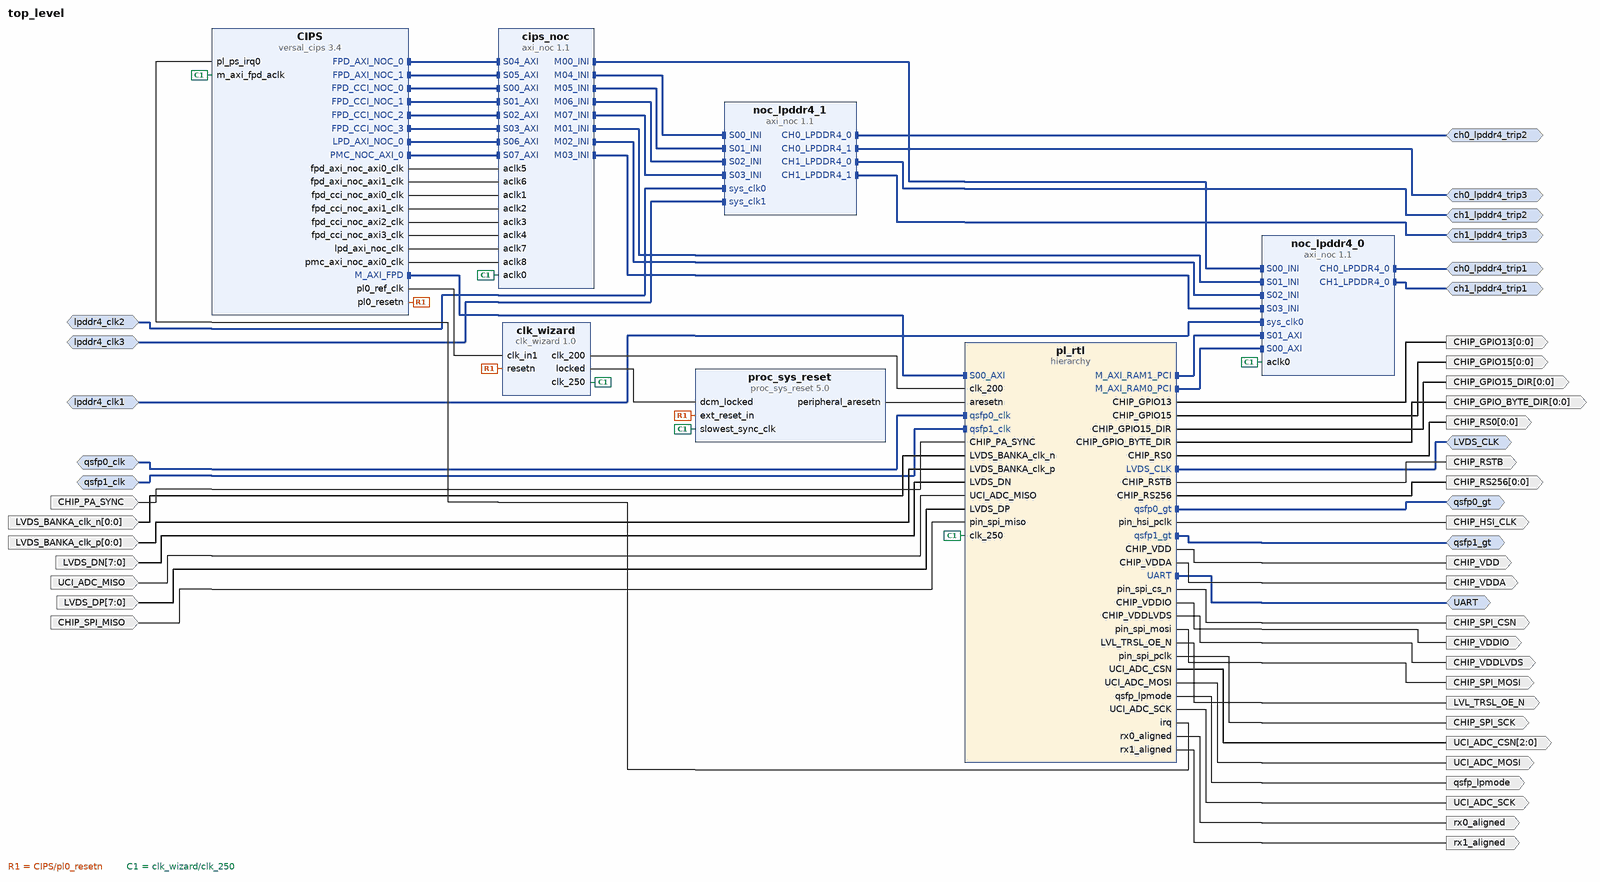
[diagram p0: block diagram of the top level]
# Vivado block design top_level, xcvp1202-vsva2785-2MP-e-S, Vivado 2024.2
create_bd_design top_level

create_bd_intf_port -mode Master -vlnv xilinx.com:interface:lpddr4_rtl:1.0 ch0_lpddr4_trip1
create_bd_intf_port -mode Master -vlnv xilinx.com:interface:lpddr4_rtl:1.0 ch0_lpddr4_trip2
create_bd_intf_port -mode Master -vlnv xilinx.com:interface:lpddr4_rtl:1.0 ch0_lpddr4_trip3
create_bd_intf_port -mode Master -vlnv xilinx.com:interface:lpddr4_rtl:1.0 ch1_lpddr4_trip1
create_bd_intf_port -mode Master -vlnv xilinx.com:interface:lpddr4_rtl:1.0 ch1_lpddr4_trip2
create_bd_intf_port -mode Master -vlnv xilinx.com:interface:lpddr4_rtl:1.0 ch1_lpddr4_trip3
create_bd_intf_port -mode Slave -vlnv xilinx.com:interface:diff_clock_rtl:1.0 lpddr4_clk1
set_property -dict {CONFIG.FREQ_HZ 200321000} [get_bd_intf_ports lpddr4_clk1]
create_bd_intf_port -mode Slave -vlnv xilinx.com:interface:diff_clock_rtl:1.0 lpddr4_clk2
set_property -dict {CONFIG.FREQ_HZ 200321000} [get_bd_intf_ports lpddr4_clk2]
create_bd_intf_port -mode Slave -vlnv xilinx.com:interface:diff_clock_rtl:1.0 lpddr4_clk3
set_property -dict {CONFIG.FREQ_HZ 200321000} [get_bd_intf_ports lpddr4_clk3]
create_bd_intf_port -mode Master -vlnv xilinx.com:interface:uart_rtl:1.0 UART
create_bd_intf_port -mode Master -vlnv xilinx.com:interface:diff_clock_rtl:1.0 LVDS_CLK
create_bd_intf_port -mode Master -vlnv xilinx.com:interface:gt_rtl:1.0 qsfp0_gt
create_bd_intf_port -mode Master -vlnv xilinx.com:interface:gt_rtl:1.0 qsfp1_gt
create_bd_intf_port -mode Slave -vlnv xilinx.com:interface:diff_clock_rtl:1.0 qsfp0_clk
set_property -dict {CONFIG.FREQ_HZ 156250000} [get_bd_intf_ports qsfp0_clk]
create_bd_intf_port -mode Slave -vlnv xilinx.com:interface:diff_clock_rtl:1.0 qsfp1_clk
set_property -dict {CONFIG.FREQ_HZ 156250000} [get_bd_intf_ports qsfp1_clk]
create_bd_port -dir O CHIP_SPI_CSN
create_bd_port -dir O CHIP_SPI_MOSI
create_bd_port -dir O CHIP_SPI_SCK
create_bd_port -dir I CHIP_SPI_MISO
create_bd_port -dir O -from 2 -to 0 UCI_ADC_CSN
create_bd_port -dir O UCI_ADC_SCK
create_bd_port -dir O UCI_ADC_MOSI
create_bd_port -dir I UCI_ADC_MISO
create_bd_port -dir O CHIP_RSTB
create_bd_port -dir O LVL_TRSL_OE_N
create_bd_port -dir O CHIP_HSI_CLK
create_bd_port -dir O CHIP_VDDIO
create_bd_port -dir O CHIP_VDDLVDS
create_bd_port -dir O CHIP_VDD
create_bd_port -dir O CHIP_VDDA
create_bd_port -dir O -from 0 -to 0 CHIP_RS0
create_bd_port -dir O -from 0 -to 0 CHIP_RS256
create_bd_port -dir O -from 0 -to 0 CHIP_GPIO_BYTE_DIR
create_bd_port -dir O -from 0 -to 0 CHIP_GPIO15
create_bd_port -dir O -from 0 -to 0 CHIP_GPIO13
create_bd_port -dir O -from 0 -to 0 CHIP_GPIO15_DIR
create_bd_port -dir I CHIP_PA_SYNC
create_bd_port -dir I -from 7 -to 0 LVDS_DP
create_bd_port -dir I -from 7 -to 0 LVDS_DN
create_bd_port -dir I -from 0 -to 0 LVDS_BANKA_clk_p
create_bd_port -dir I -from 0 -to 0 LVDS_BANKA_clk_n
create_bd_port -dir O rx0_aligned
create_bd_port -dir O qsfp_lpmode
create_bd_port -dir O rx1_aligned

create_bd_cell -type ip -vlnv xilinx.com:ip:versal_cips:3.4 CIPS
set_property -dict [list \
  CONFIG.CLOCK_MODE Custom \
  CONFIG.DDR_MEMORY_MODE Custom \
  CONFIG.PS_BOARD_INTERFACE ps_pmc_fixed_io \
  CONFIG.PS_PL_CONNECTIVITY_MODE Custom \
  CONFIG.PS_PMC_CONFIG {['CLOCK_MODE Custom', 'DDR_MEMORY_MODE Custom', 'DESIGN_MODE 1', 'DEVICE_INTEGRITY_MODE {Sysmon temperature voltage and external IO monitoring}', 'PMC_CRP_PL0_REF_CTRL_FREQMHZ 99.999992', 'PMC_GPIO0_MIO_PERIPHERAL {{ENABLE 1} {IO {PMC_MIO 0 .. 25}}}', 'PMC_GPIO1_MIO_PERIPHERAL {{ENABLE 1} {IO {PMC_MIO 26 .. 51}}}', 'PMC_MIO37 {{AUX_IO 0} {DIRECTION out} {DRIVE_STRENGTH 8mA} {OUTPUT_DATA high} {PULL pullup} {SCHMITT 0} {SLEW slow} {USAGE GPIO}}', 'PMC_QSPI_FBCLK {{ENABLE 1} {IO {PMC_MIO 6}}}', 'PMC_QSPI_PERIPHERAL_DATA_MODE x4', 'PMC_QSPI_PERIPHERAL_ENABLE 1', 'PMC_QSPI_PERIPHERAL_MODE {Dual Parallel}', 'PMC_REF_CLK_FREQMHZ 33.3333', 'PMC_SD1 {{CD_ENABLE 1} {CD_IO {PMC_MIO 28}} {POW_ENABLE 1} {POW_IO {PMC_MIO 51}} {RESET_ENABLE 0} {RESET_IO {PMC_MIO 12}} {WP_ENABLE 0} {WP_IO {PMC_MIO 1}}}', 'PMC_SD1_PERIPHERAL {{CLK_100_SDR_OTAP_DLY 0x3} {CLK_200_SDR_OTAP_DLY 0x2} {CLK_50_DDR_ITAP_DLY 0x36} {CLK_50_DDR_OTAP_DLY 0x3} {CLK_50_SDR_ITAP_DLY 0x2C} {CLK_50_SDR_OTAP_DLY 0x4} {ENABLE 1} {IO {PMC_MIO 26 .. 36}}}', 'PMC_SD1_SLOT_TYPE {SD 3.0}', 'PMC_USE_PMC_NOC_AXI0 1', 'PS_BOARD_INTERFACE ps_pmc_fixed_io', 'PS_ENET0_MDIO {{ENABLE 1} {IO {PS_MIO 24 .. 25}}}', 'PS_ENET0_PERIPHERAL {{ENABLE 1} {IO {PS_MIO 0 .. 11}}}', 'PS_GEN_IPI0_ENABLE 1', 'PS_GEN_IPI0_MASTER A72', 'PS_GEN_IPI1_ENABLE 1', 'PS_GEN_IPI1_MASTER A72', 'PS_GEN_IPI2_ENABLE 1', 'PS_GEN_IPI2_MASTER A72', 'PS_GEN_IPI3_ENABLE 1', 'PS_GEN_IPI3_MASTER A72', 'PS_GEN_IPI4_ENABLE 1', 'PS_GEN_IPI4_MASTER A72', 'PS_GEN_IPI5_ENABLE 1', 'PS_GEN_IPI5_MASTER A72', 'PS_GEN_IPI6_ENABLE 1', 'PS_GEN_IPI6_MASTER A72', 'PS_I2C0_PERIPHERAL {{ENABLE 1} {IO {PMC_MIO 46 .. 47}}}', 'PS_I2C1_PERIPHERAL {{ENABLE 1} {IO {PMC_MIO 44 .. 45}}}', 'PS_I2CSYSMON_PERIPHERAL {{ENABLE 0} {IO {PMC_MIO 39 .. 40}}}', 'PS_IRQ_USAGE {{CH0 1} {CH1 0} {CH10 0} {CH11 0} {CH12 0} {CH13 0} {CH14 0} {CH15 0} {CH2 0} {CH3 0} {CH4 0} {CH5 0} {CH6 0} {CH7 0} {CH8 0} {CH9 0}}', 'PS_MIO7 {{AUX_IO 0} {DIRECTION in} {DRIVE_STRENGTH 8mA} {OUTPUT_DATA default} {PULL disable} {SCHMITT 0} {SLEW slow} {USAGE Reserved}}', 'PS_MIO9 {{AUX_IO 0} {DIRECTION in} {DRIVE_STRENGTH 8mA} {OUTPUT_DATA default} {PULL disable} {SCHMITT 0} {SLEW slow} {USAGE Reserved}}', 'PS_NUM_FABRIC_RESETS 1', 'PS_PCIE_EP_RESET1_IO {PS_MIO 18}', 'PS_PCIE_EP_RESET2_IO {PS_MIO 19}', 'PS_PCIE_RESET {ENABLE 1}', 'PS_PL_CONNECTIVITY_MODE Custom', 'PS_TTC0_PERIPHERAL_ENABLE 1', 'PS_UART0_PERIPHERAL {{ENABLE 1} {IO {PMC_MIO 42 .. 43}}}', 'PS_USB3_PERIPHERAL {{ENABLE 1} {IO {PMC_MIO 13 .. 25}}}', 'PS_USE_FPD_AXI_NOC0 1', 'PS_USE_FPD_AXI_NOC1 1', 'PS_USE_FPD_CCI_NOC 1', 'PS_USE_M_AXI_FPD 1', 'PS_USE_NOC_LPD_AXI0 1', 'PS_USE_PMCPL_CLK0 1', 'SMON_ALARMS Set_Alarms_On', 'SMON_ENABLE_TEMP_AVERAGING 0', 'SMON_INTERFACE_TO_USE I2C', 'SMON_MEAS36 {{ALARM_ENABLE 1} {ALARM_LOWER 0.00} {ALARM_UPPER 2.00} {AVERAGE_EN 0} {ENABLE 1} {MODE {2 V unipolar}} {NAME VCCAUX} {SUPPLY_NUM 0}}', 'SMON_MEAS37 {{ALARM_ENABLE 1} {ALARM_LOWER 0.00} {ALARM_UPPER 2.00} {AVERAGE_EN 0} {ENABLE 1} {MODE {2 V unipolar}} {NAME VCCAUX_PMC} {SUPPLY_NUM 1}}', 'SMON_MEAS58 {{ALARM_ENABLE 1} {ALARM_LOWER 0.00} {ALARM_UPPER 2.00} {AVERAGE_EN 0} {ENABLE 1} {MODE {2 V unipolar}} {NAME VCC_PMC} {SUPPLY_NUM 2}}', 'SMON_MEAS59 {{ALARM_ENABLE 1} {ALARM_LOWER 0.00} {ALARM_UPPER 2.00} {AVERAGE_EN 0} {ENABLE 1} {MODE {2 V unipolar}} {NAME VCC_PSFP} {SUPPLY_NUM 3}}', 'SMON_MEAS60 {{ALARM_ENABLE 1} {ALARM_LOWER 0.00} {ALARM_UPPER 2.00} {AVERAGE_EN 0} {ENABLE 1} {MODE {2 V unipolar}} {NAME VCC_PSLP} {SUPPLY_NUM 4}}', 'SMON_MEAS62 {{ALARM_ENABLE 1} {ALARM_LOWER 0.00} {ALARM_UPPER 2.00} {AVERAGE_EN 0} {ENABLE 1} {MODE {2 V unipolar}} {NAME VCC_SOC} {SUPPLY_NUM 5}}', 'SMON_MEAS63 {{ALARM_ENABLE 1} {ALARM_LOWER 0.00} {ALARM_UPPER 1.00} {AVERAGE_EN 0} {ENABLE 1} {MODE {2 V unipolar}} {NAME VP_VN} {SUPPLY_NUM 6}}', 'SMON_PMBUS_ADDRESS 0x18', 'SMON_TEMP_AVERAGING_SAMPLES 0']} \
] [get_bd_cells CIPS]
create_bd_cell -type hier pl_rtl
create_bd_cell -type ip -vlnv xilinx.com:ip:axi_noc:1.1 cips_noc
set_property -dict {CONFIG.NUM_CLKS 9 CONFIG.NUM_MI 0 CONFIG.NUM_NMI 8 CONFIG.NUM_NSI 0 CONFIG.NUM_SI 8} [get_bd_cells cips_noc]
create_bd_cell -type ip -vlnv xilinx.com:ip:clk_wizard:1.0 clk_wizard
set_property -dict [list \
  CONFIG.CLKOUT_DRIVES BUFG,BUFG,BUFG,BUFG,BUFG,BUFG,BUFG \
  CONFIG.CLKOUT_DYN_PS None,None,None,None,None,None,None \
  CONFIG.CLKOUT_GROUPING Auto,Auto,Auto,Auto,Auto,Auto,Auto \
  CONFIG.CLKOUT_MATCHED_ROUTING false,false,false,false,false,false,false \
  CONFIG.CLKOUT_PORT clk_250,clk_200,clk_out3,clk_out4,clk_out5,clk_out6,clk_out7 \
  CONFIG.CLKOUT_REQUESTED_DUTY_CYCLE 50.000,50.000,50.000,50.000,50.000,50.000,50.000 \
  CONFIG.CLKOUT_REQUESTED_OUT_FREQUENCY 250,200,300.000,100.000,100.000,100.000,100.000 \
  CONFIG.CLKOUT_REQUESTED_PHASE 0.000,0.000,0.000,0.000,0.000,0.000,0.000 \
  CONFIG.CLKOUT_USED true,true,false,false,false,false,false \
  CONFIG.JITTER_SEL Min_O_Jitter \
  CONFIG.PRIM_SOURCE No_buffer \
  CONFIG.RESET_TYPE ACTIVE_LOW \
  CONFIG.USE_LOCKED true \
  CONFIG.USE_PHASE_ALIGNMENT true \
  CONFIG.USE_RESET true \
] [get_bd_cells clk_wizard]
create_bd_cell -type ip -vlnv xilinx.com:ip:axi_noc:1.1 noc_lpddr4_0
set_property -dict [list \
  CONFIG.CH0_LPDDR4_0_BOARD_INTERFACE ch0_lpddr4_trip1 \
  CONFIG.CH1_LPDDR4_0_BOARD_INTERFACE ch1_lpddr4_trip1 \
  CONFIG.MC_CHANNEL_INTERLEAVING true \
  CONFIG.MC_CHAN_REGION1 DDR_LOW1 \
  CONFIG.MC_CH_INTERLEAVING_SIZE 4K_Bytes \
  CONFIG.NUM_MCP 4 \
  CONFIG.NUM_MI 0 \
  CONFIG.NUM_NSI 4 \
  CONFIG.NUM_SI 2 \
  CONFIG.sys_clk0_BOARD_INTERFACE lpddr4_clk1 \
] [get_bd_cells noc_lpddr4_0]
create_bd_cell -type ip -vlnv xilinx.com:ip:axi_noc:1.1 noc_lpddr4_1
set_property -dict [list \
  CONFIG.CH0_LPDDR4_0_BOARD_INTERFACE ch0_lpddr4_trip2 \
  CONFIG.CH0_LPDDR4_1_BOARD_INTERFACE ch0_lpddr4_trip3 \
  CONFIG.CH1_LPDDR4_0_BOARD_INTERFACE ch1_lpddr4_trip2 \
  CONFIG.CH1_LPDDR4_1_BOARD_INTERFACE ch1_lpddr4_trip3 \
  CONFIG.MC_CHAN_REGION0 DDR_CH1 \
  CONFIG.NUM_MCP 4 \
  CONFIG.NUM_MI 0 \
  CONFIG.NUM_NSI 4 \
  CONFIG.NUM_SI 0 \
  CONFIG.sys_clk0_BOARD_INTERFACE lpddr4_clk2 \
  CONFIG.sys_clk1_BOARD_INTERFACE lpddr4_clk3 \
] [get_bd_cells noc_lpddr4_1]
create_bd_cell -type ip -vlnv xilinx.com:ip:proc_sys_reset:5.0 proc_sys_reset

# ---- hierarchy /pl_rtl ----
current_bd_instance /pl_rtl
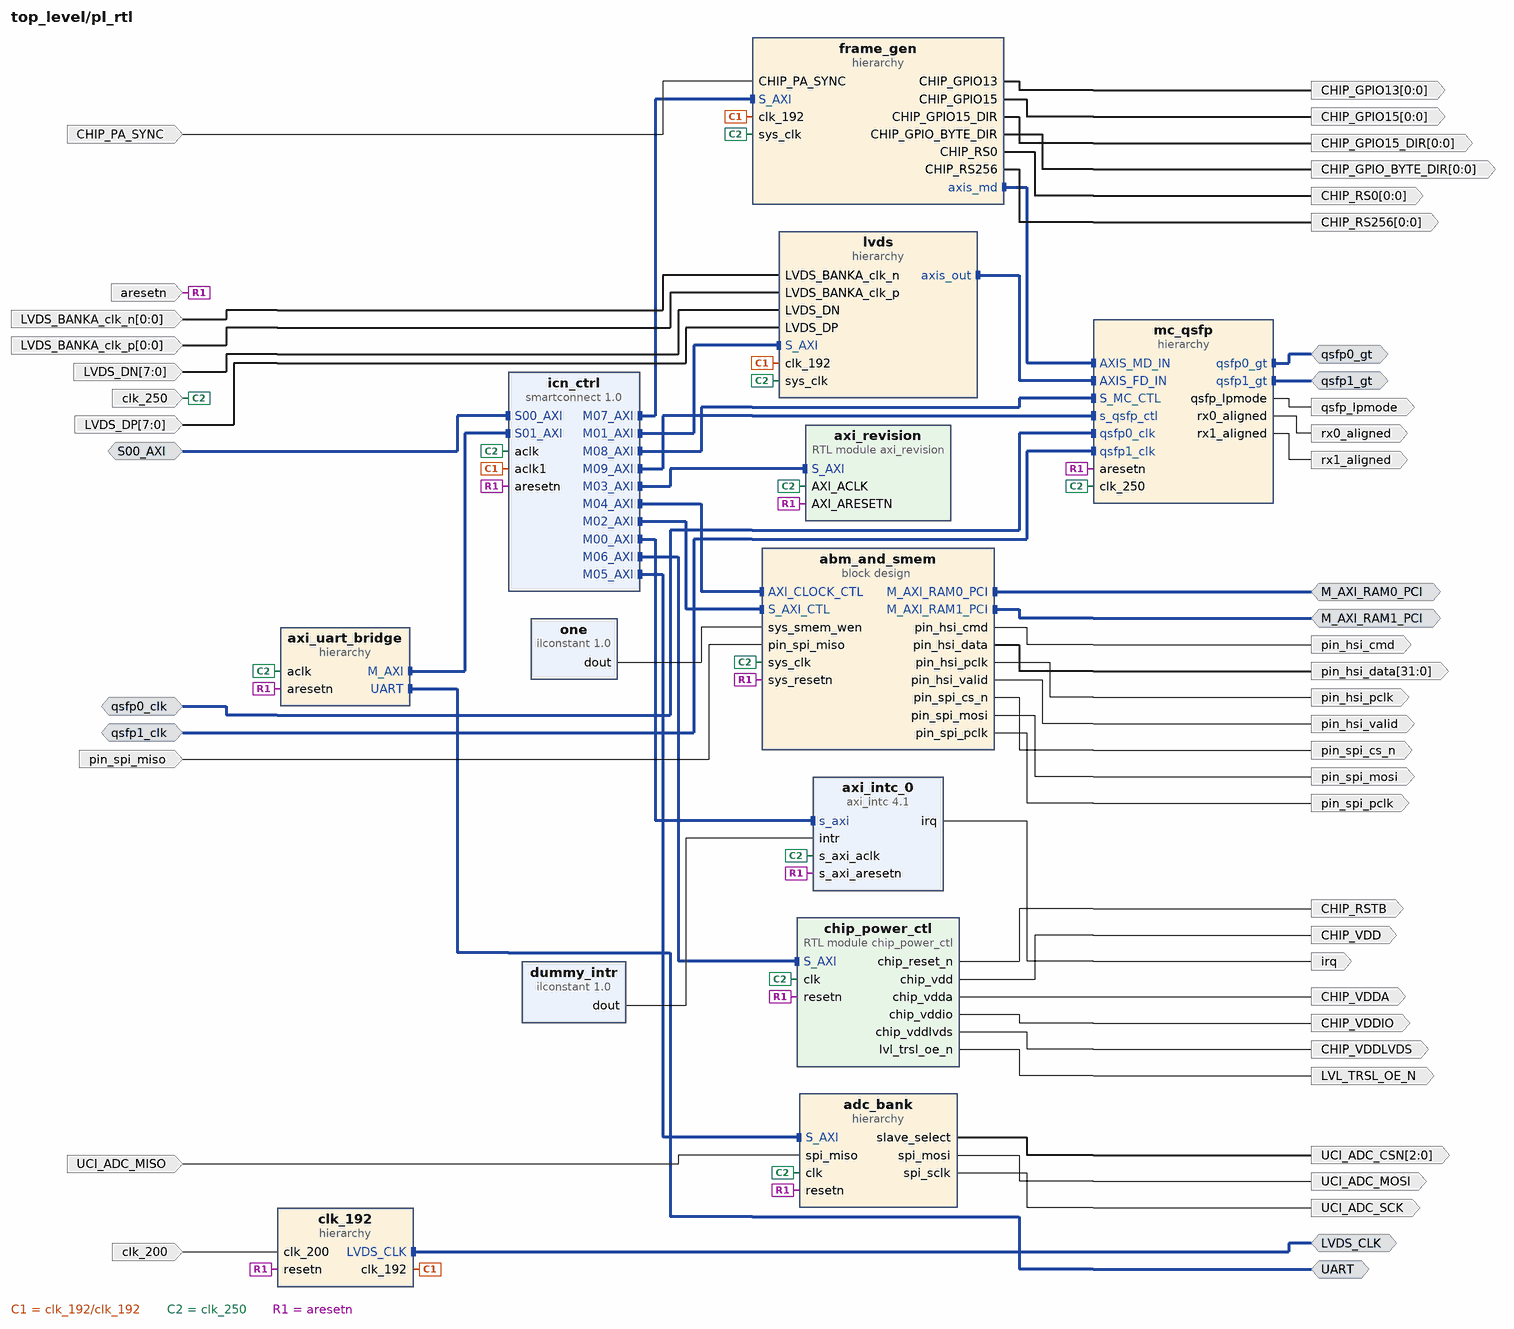
[diagram p1: block diagram inside /pl_rtl]
create_bd_intf_pin -mode Slave -vlnv xilinx.com:interface:aximm_rtl:1.0 S00_AXI
create_bd_intf_pin -mode Master -vlnv xilinx.com:interface:uart_rtl:1.0 UART
create_bd_intf_pin -mode Master -vlnv xilinx.com:interface:diff_clock_rtl:1.0 LVDS_CLK
create_bd_intf_pin -mode Master -vlnv xilinx.com:interface:aximm_rtl:1.0 M_AXI_RAM1_PCI
create_bd_intf_pin -mode Master -vlnv xilinx.com:interface:aximm_rtl:1.0 M_AXI_RAM0_PCI
create_bd_intf_pin -mode Slave -vlnv xilinx.com:interface:diff_clock_rtl:1.0 qsfp0_clk
create_bd_intf_pin -mode Slave -vlnv xilinx.com:interface:diff_clock_rtl:1.0 qsfp1_clk
create_bd_intf_pin -mode Master -vlnv xilinx.com:interface:gt_rtl:1.0 qsfp0_gt
create_bd_intf_pin -mode Master -vlnv xilinx.com:interface:gt_rtl:1.0 qsfp1_gt
create_bd_pin -dir I -type clk clk_250
create_bd_pin -dir I -type rst aresetn
create_bd_pin -dir O -type intr irq
create_bd_pin -dir I clk_200
create_bd_pin -dir I pin_spi_miso
create_bd_pin -dir O pin_spi_cs_n
create_bd_pin -dir O pin_spi_mosi
create_bd_pin -dir O pin_hsi_cmd
create_bd_pin -dir O pin_hsi_valid
create_bd_pin -dir O pin_hsi_pclk
create_bd_pin -dir O -from 31 -to 0 pin_hsi_data
create_bd_pin -dir O pin_spi_pclk
create_bd_pin -dir O -from 2 -to 0 UCI_ADC_CSN
create_bd_pin -dir O UCI_ADC_SCK
create_bd_pin -dir O UCI_ADC_MOSI
create_bd_pin -dir I UCI_ADC_MISO
create_bd_pin -dir O CHIP_RSTB
create_bd_pin -dir O LVL_TRSL_OE_N
create_bd_pin -dir O CHIP_VDDIO
create_bd_pin -dir O CHIP_VDD
create_bd_pin -dir O CHIP_VDDLVDS
create_bd_pin -dir O CHIP_VDDA
create_bd_pin -dir O -from 0 -to 0 CHIP_GPIO15_DIR
create_bd_pin -dir O -from 0 -to 0 CHIP_GPIO13
create_bd_pin -dir O -from 0 -to 0 CHIP_GPIO15
create_bd_pin -dir O -from 0 -to 0 CHIP_GPIO_BYTE_DIR
create_bd_pin -dir O -from 0 -to 0 CHIP_RS256
create_bd_pin -dir O -from 0 -to 0 CHIP_RS0
create_bd_pin -dir I CHIP_PA_SYNC
create_bd_pin -dir I -from 7 -to 0 LVDS_DP
create_bd_pin -dir I -from 7 -to 0 LVDS_DN
create_bd_pin -dir I -from 0 -to 0 LVDS_BANKA_clk_p
create_bd_pin -dir I -from 0 -to 0 LVDS_BANKA_clk_n
create_bd_pin -dir O rx0_aligned
create_bd_pin -dir O rx1_aligned
create_bd_pin -dir O qsfp_lpmode

create_bd_cell -type ip -vlnv xilinx.com:ip:smartconnect:1.0 icn_ctrl
set_property -dict {CONFIG.NUM_CLKS 2 CONFIG.NUM_MI 10 CONFIG.NUM_SI 2} [get_bd_cells icn_ctrl]
create_bd_cell -type hier axi_uart_bridge
create_bd_cell -type module -reference axi_revision axi_revision
create_bd_cell -type ip -vlnv xilinx.com:ip:axi_intc:4.1 axi_intc_0
set_property -dict {CONFIG.C_ASYNC_INTR 0xFFFFFFFF CONFIG.C_IRQ_CONNECTION 1} [get_bd_cells axi_intc_0]
create_bd_cell -type inline_hdl -vlnv xilinx.com:inline_hdl:ilconstant:1.0 dummy_intr
set_property -dict {CONFIG.CONST_VAL 0} [get_bd_cells dummy_intr]
create_bd_cell -type container -reference abm_and_smem abm_and_smem
set_property -dict [list \
  CONFIG.ACTIVE_SIM_BD abm_and_smem.bd \
  CONFIG.ACTIVE_SYNTH_BD abm_and_smem.bd \
  CONFIG.ENABLE_DFX 0 \
  CONFIG.LIST_SIM_BD abm_and_smem.bd \
  CONFIG.LIST_SYNTH_BD abm_and_smem.bd \
  CONFIG.LOCK_PROPAGATE 0 \
] [get_bd_cells abm_and_smem]
create_bd_cell -type inline_hdl -vlnv xilinx.com:inline_hdl:ilconstant:1.0 one
create_bd_cell -type hier clk_192
create_bd_cell -type hier adc_bank
create_bd_cell -type module -reference chip_power_ctl chip_power_ctl
create_bd_cell -type hier frame_gen
create_bd_cell -type hier lvds
create_bd_cell -type hier mc_qsfp

# ---- hierarchy /pl_rtl/axi_uart_bridge ----
current_bd_instance /pl_rtl/axi_uart_bridge
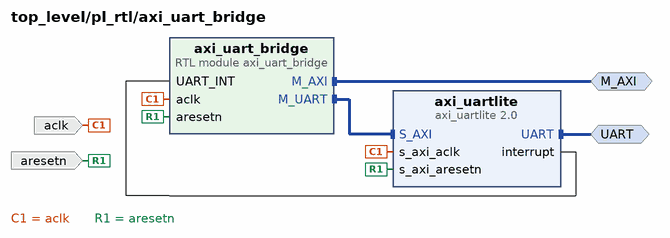
[diagram p2: block diagram inside /pl_rtl/axi_uart_bridge]
create_bd_intf_pin -mode Master -vlnv xilinx.com:interface:uart_rtl:1.0 UART
create_bd_intf_pin -mode Master -vlnv xilinx.com:interface:aximm_rtl:1.0 M_AXI
create_bd_pin -dir I aclk
create_bd_pin -dir I aresetn

create_bd_cell -type module -reference axi_uart_bridge axi_uart_bridge
create_bd_cell -type ip -vlnv xilinx.com:ip:axi_uartlite:2.0 axi_uartlite
set_property -dict {CONFIG.C_BAUDRATE 115200} [get_bd_cells axi_uartlite]

# ---- hierarchy /pl_rtl/clk_192 ----
current_bd_instance /pl_rtl/clk_192
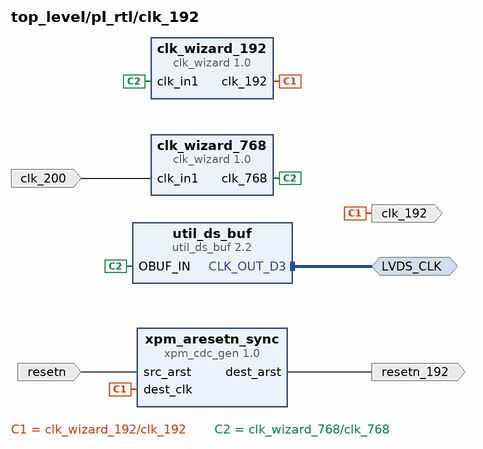
[diagram p3: block diagram inside /pl_rtl/clk_192]
create_bd_intf_pin -mode Master -vlnv xilinx.com:interface:diff_clock_rtl:1.0 LVDS_CLK
create_bd_pin -dir I clk_200
create_bd_pin -dir O clk_192
create_bd_pin -dir I resetn
create_bd_pin -dir O resetn_192

create_bd_cell -type ip -vlnv xilinx.com:ip:clk_wizard:1.0 clk_wizard_768
set_property -dict [list \
  CONFIG.CLKOUT_DRIVES BUFG,BUFG,BUFG,BUFG,BUFG,BUFG,BUFG \
  CONFIG.CLKOUT_DYN_PS None,None,None,None,None,None,None \
  CONFIG.CLKOUT_GROUPING Auto,Auto,Auto,Auto,Auto,Auto,Auto \
  CONFIG.CLKOUT_MATCHED_ROUTING false,false,false,false,false,false,false \
  CONFIG.CLKOUT_PORT clk_768,clk_768,clk_out3,clk_out4,clk_out5,clk_out6,clk_out7 \
  CONFIG.CLKOUT_REQUESTED_DUTY_CYCLE 50.000,50.000,50.000,50.000,50.000,50.000,50.000 \
  CONFIG.CLKOUT_REQUESTED_OUT_FREQUENCY 768,768,100.000,100.000,100.000,100.000,100.000 \
  CONFIG.CLKOUT_REQUESTED_PHASE 0.000,0.000,0.000,0.000,0.000,0.000,0.000 \
  CONFIG.CLKOUT_USED true,false,false,false,false,false,false \
] [get_bd_cells clk_wizard_768]
create_bd_cell -type ip -vlnv xilinx.com:ip:xpm_cdc_gen:1.0 xpm_aresetn_sync
set_property -dict {CONFIG.CDC_TYPE xpm_cdc_async_rst} [get_bd_cells xpm_aresetn_sync]
create_bd_cell -type ip -vlnv xilinx.com:ip:util_ds_buf:2.2 util_ds_buf
set_property -dict {CONFIG.C_BUF_TYPE OBUFDS} [get_bd_cells util_ds_buf]
create_bd_cell -type ip -vlnv xilinx.com:ip:clk_wizard:1.0 clk_wizard_192
set_property -dict [list \
  CONFIG.CLKOUT_DRIVES BUFG,BUFG,BUFG,BUFG,BUFG,BUFG,BUFG \
  CONFIG.CLKOUT_DYN_PS None,None,None,None,None,None,None \
  CONFIG.CLKOUT_GROUPING Auto,Auto,Auto,Auto,Auto,Auto,Auto \
  CONFIG.CLKOUT_MATCHED_ROUTING false,false,false,false,false,false,false \
  CONFIG.CLKOUT_PORT clk_192,clk_out2,clk_out3,clk_out4,clk_out5,clk_out6,clk_out7 \
  CONFIG.CLKOUT_REQUESTED_DUTY_CYCLE 50.000,50.000,50.000,50.000,50.000,50.000,50.000 \
  CONFIG.CLKOUT_REQUESTED_OUT_FREQUENCY 192,100.000,100.000,100.000,100.000,100.000,100.000 \
  CONFIG.CLKOUT_REQUESTED_PHASE 0,0.000,0.000,0.000,0.000,0.000,0.000 \
  CONFIG.CLKOUT_USED true,false,false,false,false,false,false \
] [get_bd_cells clk_wizard_192]

# ---- hierarchy /pl_rtl/adc_bank ----
current_bd_instance /pl_rtl/adc_bank
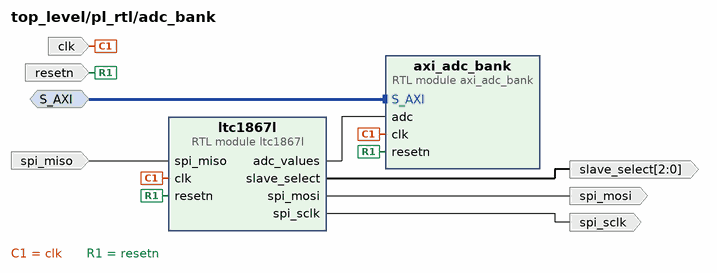
[diagram p4: block diagram inside /pl_rtl/adc_bank]
create_bd_intf_pin -mode Slave -vlnv xilinx.com:interface:aximm_rtl:1.0 S_AXI
create_bd_pin -dir I clk
create_bd_pin -dir I resetn
create_bd_pin -dir I spi_miso
create_bd_pin -dir O -from 2 -to 0 slave_select
create_bd_pin -dir O spi_sclk
create_bd_pin -dir O spi_mosi

create_bd_cell -type module -reference axi_adc_bank axi_adc_bank
set_property -dict {CONFIG.ADC_COUNT 3} [get_bd_cells axi_adc_bank]
create_bd_cell -type module -reference ltc1867l ltc1867l
set_property -dict {CONFIG.ADC_COUNT 3} [get_bd_cells ltc1867l]

# ---- hierarchy /pl_rtl/frame_gen ----
current_bd_instance /pl_rtl/frame_gen
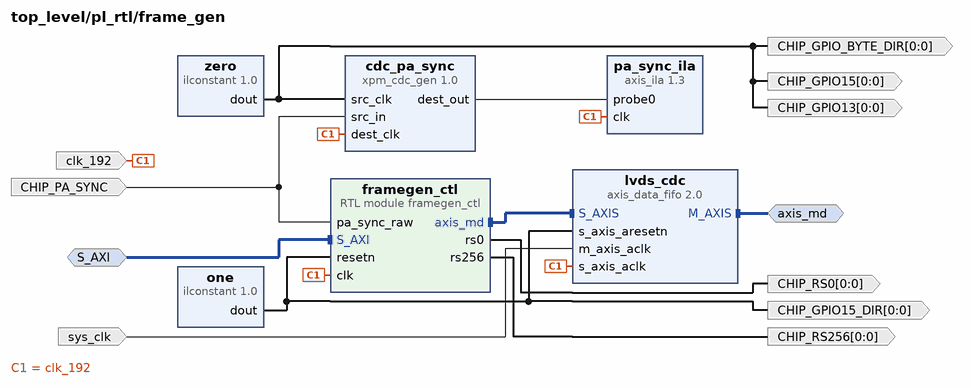
[diagram p5: block diagram inside /pl_rtl/frame_gen]
create_bd_intf_pin -mode Slave -vlnv xilinx.com:interface:aximm_rtl:1.0 S_AXI
create_bd_intf_pin -mode Master -vlnv xilinx.com:interface:axis_rtl:1.0 axis_md
create_bd_pin -dir O -from 0 -to 0 CHIP_GPIO15_DIR
create_bd_pin -dir O -from 0 -to 0 CHIP_GPIO13
create_bd_pin -dir O -from 0 -to 0 CHIP_GPIO15
create_bd_pin -dir O -from 0 -to 0 CHIP_GPIO_BYTE_DIR
create_bd_pin -dir O -from 0 -to 0 CHIP_RS256
create_bd_pin -dir O -from 0 -to 0 CHIP_RS0
create_bd_pin -dir I CHIP_PA_SYNC
create_bd_pin -dir I clk_192
create_bd_pin -dir I sys_clk

create_bd_cell -type inline_hdl -vlnv xilinx.com:inline_hdl:ilconstant:1.0 one
create_bd_cell -type inline_hdl -vlnv xilinx.com:inline_hdl:ilconstant:1.0 zero
set_property -dict {CONFIG.CONST_VAL 0} [get_bd_cells zero]
create_bd_cell -type ip -vlnv xilinx.com:ip:xpm_cdc_gen:1.0 cdc_pa_sync
set_property -dict [list \
  CONFIG.CDC_TYPE xpm_cdc_single \
  CONFIG.SIM_ASSERT_CHK false \
  CONFIG.SRC_INPUT_REG false \
] [get_bd_cells cdc_pa_sync]
create_bd_cell -type ip -vlnv xilinx.com:ip:axis_ila:1.3 pa_sync_ila
set_property -dict {CONFIG.C_MON_TYPE Net_Probes CONFIG.C_NUM_OF_PROBES 1 CONFIG.C_PROBE4_WIDTH 1} [get_bd_cells pa_sync_ila]
create_bd_cell -type module -reference framegen_ctl framegen_ctl
create_bd_cell -type ip -vlnv xilinx.com:ip:axis_data_fifo:2.0 lvds_cdc
set_property -dict {CONFIG.FIFO_DEPTH 16 CONFIG.IS_ACLK_ASYNC 1} [get_bd_cells lvds_cdc]

# ---- hierarchy /pl_rtl/lvds ----
current_bd_instance /pl_rtl/lvds
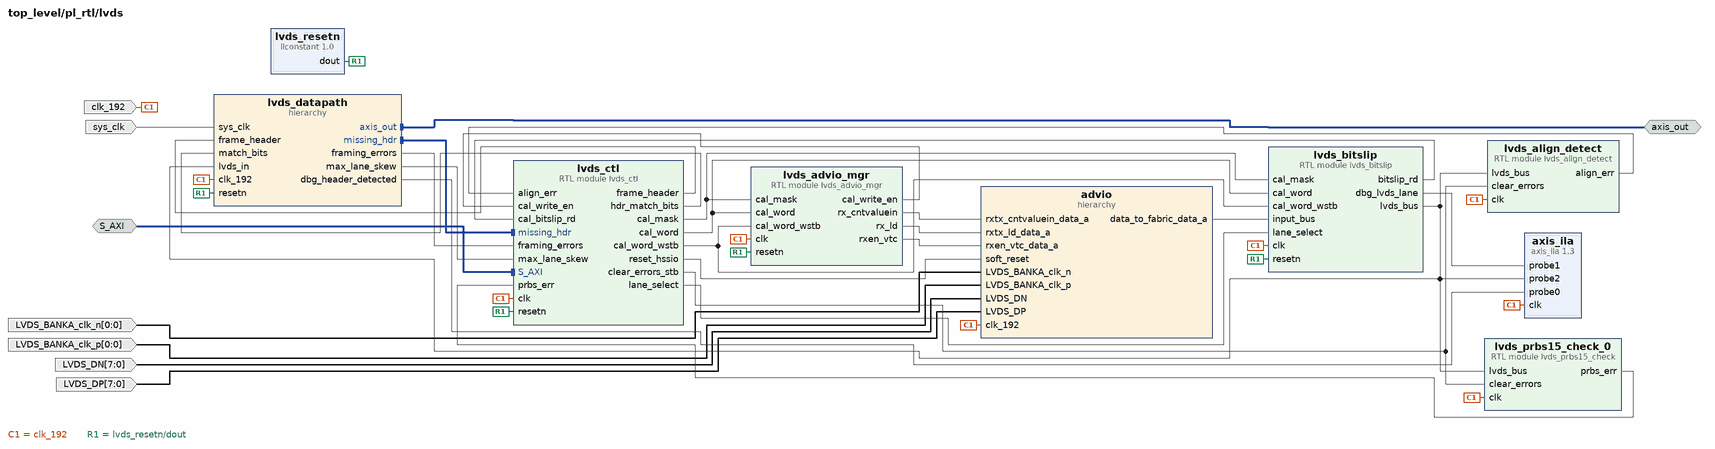
[diagram p6: block diagram inside /pl_rtl/lvds]
create_bd_intf_pin -mode Slave -vlnv xilinx.com:interface:aximm_rtl:1.0 S_AXI
create_bd_intf_pin -mode Master -vlnv xilinx.com:interface:axis_rtl:1.0 axis_out
create_bd_pin -dir I clk_192
create_bd_pin -dir I -from 7 -to 0 LVDS_DP
create_bd_pin -dir I -from 7 -to 0 LVDS_DN
create_bd_pin -dir I -from 0 -to 0 LVDS_BANKA_clk_p
create_bd_pin -dir I -from 0 -to 0 LVDS_BANKA_clk_n
create_bd_pin -dir I sys_clk

create_bd_cell -type ip -vlnv xilinx.com:ip:axis_ila:1.3 axis_ila
set_property -dict [list \
  CONFIG.C_MON_TYPE Net_Probes \
  CONFIG.C_NUM_OF_PROBES 3 \
  CONFIG.C_PROBE0_WIDTH 64 \
  CONFIG.C_PROBE1_WIDTH 8 \
  CONFIG.C_PROBE2_WIDTH 64 \
  CONFIG.C_PROBE3_WIDTH 1 \
  CONFIG.C_PROBE4_WIDTH 1 \
  CONFIG.C_PROBE5_WIDTH 1 \
  CONFIG.C_PROBE6_WIDTH 1 \
  CONFIG.C_PROBE8_WIDTH 1 \
  CONFIG.C_SLOT_0_INTF_TYPE xilinx.com:interface:axis_rtl:1.0 \
] [get_bd_cells axis_ila]
create_bd_cell -type hier advio
create_bd_cell -type module -reference lvds_ctl lvds_ctl
create_bd_cell -type module -reference lvds_advio_mgr lvds_advio_mgr
create_bd_cell -type module -reference lvds_bitslip lvds_bitslip
set_property -dict {CONFIG.LANE_COUNT 8} [get_bd_cells lvds_bitslip]
create_bd_cell -type module -reference lvds_align_detect lvds_align_detect
set_property -dict {CONFIG.LANE_COUNT 8} [get_bd_cells lvds_align_detect]
create_bd_cell -type inline_hdl -vlnv xilinx.com:inline_hdl:ilconstant:1.0 lvds_resetn
create_bd_cell -type module -reference lvds_prbs15_check lvds_prbs15_check_0
set_property -dict {CONFIG.LANE_COUNT 8} [get_bd_cells lvds_prbs15_check_0]
create_bd_cell -type hier lvds_datapath

# ---- hierarchy /pl_rtl/lvds/advio ----
current_bd_instance /pl_rtl/lvds/advio
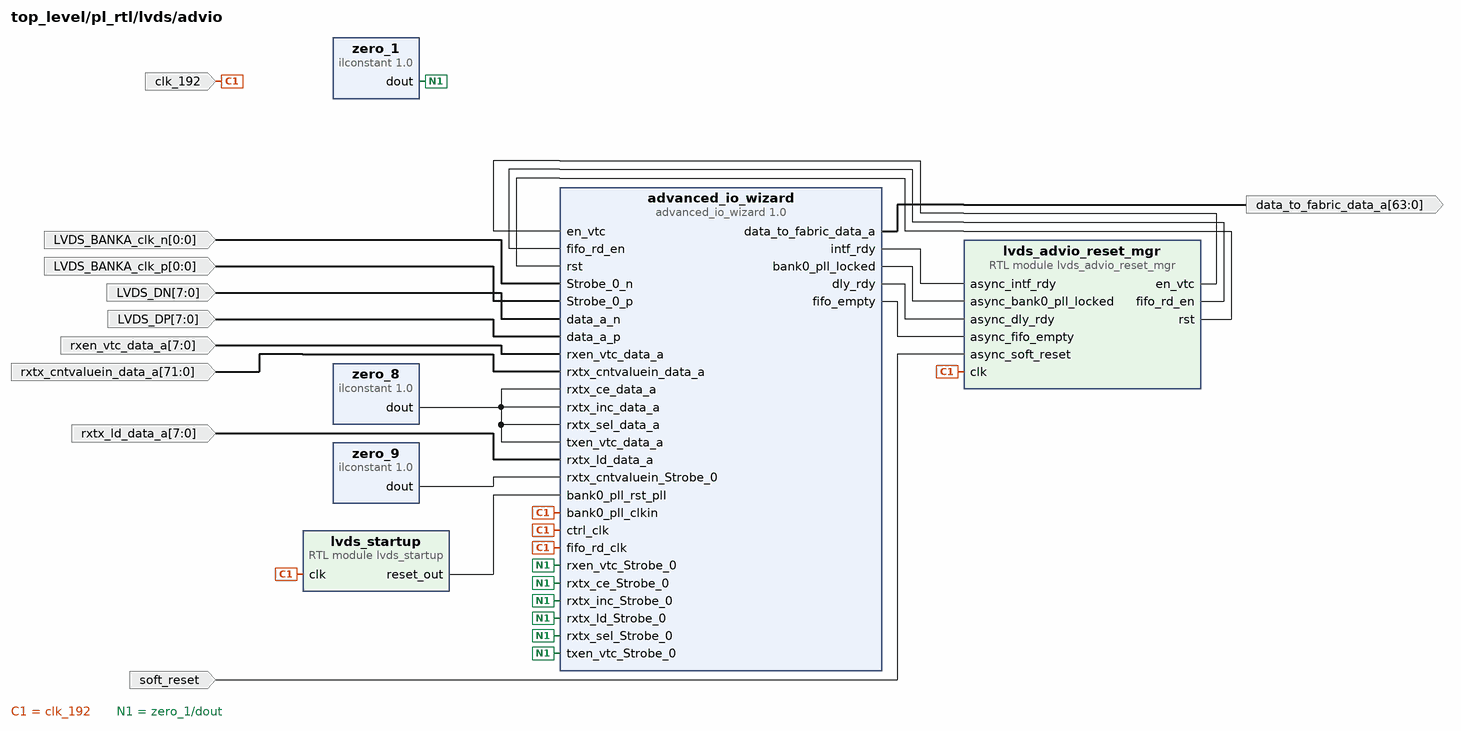
[diagram p7: block diagram inside /pl_rtl/lvds/advio]
create_bd_pin -dir I clk_192
create_bd_pin -dir I -from 7 -to 0 LVDS_DP
create_bd_pin -dir I -from 7 -to 0 LVDS_DN
create_bd_pin -dir O -from 63 -to 0 data_to_fabric_data_a
create_bd_pin -dir I -from 0 -to 0 LVDS_BANKA_clk_p
create_bd_pin -dir I -from 0 -to 0 LVDS_BANKA_clk_n
create_bd_pin -dir I -from 7 -to 0 rxtx_ld_data_a
create_bd_pin -dir I -from 7 -to 0 rxen_vtc_data_a
create_bd_pin -dir I -from 71 -to 0 rxtx_cntvaluein_data_a
create_bd_pin -dir I soft_reset

create_bd_cell -type inline_hdl -vlnv xilinx.com:inline_hdl:ilconstant:1.0 zero_8
set_property -dict {CONFIG.CONST_VAL 0 CONFIG.CONST_WIDTH 8} [get_bd_cells zero_8]
create_bd_cell -type inline_hdl -vlnv xilinx.com:inline_hdl:ilconstant:1.0 zero_9
set_property -dict {CONFIG.CONST_VAL 0 CONFIG.CONST_WIDTH 9} [get_bd_cells zero_9]
create_bd_cell -type inline_hdl -vlnv xilinx.com:inline_hdl:ilconstant:1.0 zero_1
set_property -dict {CONFIG.CONST_VAL 0} [get_bd_cells zero_1]
create_bd_cell -type module -reference lvds_startup lvds_startup
create_bd_cell -type ip -vlnv xilinx.com:ip:advanced_io_wizard:1.0 advanced_io_wizard
set_property -dict [list \
  CONFIG.BUS0_IO_TYPE DIFF \
  CONFIG.BUS0_NUM_PINS 8 \
  CONFIG.BUS0_SIG_NAME data_a \
  CONFIG.BUS0_STROBE_IO_TYPE DIFF \
  CONFIG.DATA_SPEED 1536 \
  CONFIG.DELAY_CTRL_SIG_EN 1 \
  CONFIG.DIFF_IO_STD LVDS15 \
  CONFIG.INPUT_CLK_FREQ 192.000 \
  CONFIG.PLL_CLK_SOURCE BUFG_TO_PLL \
  CONFIG.REDUCE_CONTROL_SIG_EN 0 \
] [get_bd_cells advanced_io_wizard]
create_bd_cell -type module -reference lvds_advio_reset_mgr lvds_advio_reset_mgr

# ---- hierarchy /pl_rtl/lvds/lvds_datapath ----
current_bd_instance /pl_rtl/lvds/lvds_datapath
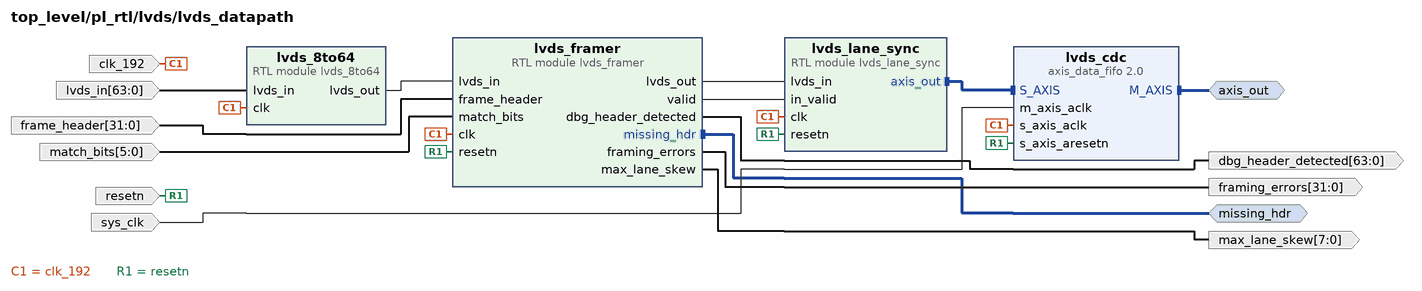
[diagram p8: block diagram inside /pl_rtl/lvds/lvds_datapath]
create_bd_intf_pin -mode Master -vlnv xilinx.com:interface:axis_rtl:1.0 missing_hdr
create_bd_intf_pin -mode Master -vlnv xilinx.com:interface:axis_rtl:1.0 axis_out
create_bd_pin -dir I clk_192
create_bd_pin -dir I -from 63 -to 0 lvds_in
create_bd_pin -dir I -type rst resetn
create_bd_pin -dir I -from 31 -to 0 frame_header
create_bd_pin -dir I -from 5 -to 0 match_bits
create_bd_pin -dir O -from 31 -to 0 framing_errors
create_bd_pin -dir O -from 7 -to 0 max_lane_skew
create_bd_pin -dir O -from 63 -to 0 dbg_header_detected
create_bd_pin -dir I sys_clk

create_bd_cell -type module -reference lvds_8to64 lvds_8to64
create_bd_cell -type module -reference lvds_framer lvds_framer
create_bd_cell -type module -reference lvds_lane_sync lvds_lane_sync
create_bd_cell -type ip -vlnv xilinx.com:ip:axis_data_fifo:2.0 lvds_cdc
set_property -dict {CONFIG.FIFO_DEPTH 16 CONFIG.IS_ACLK_ASYNC 1} [get_bd_cells lvds_cdc]

# ---- hierarchy /pl_rtl/mc_qsfp ----
current_bd_instance /pl_rtl/mc_qsfp
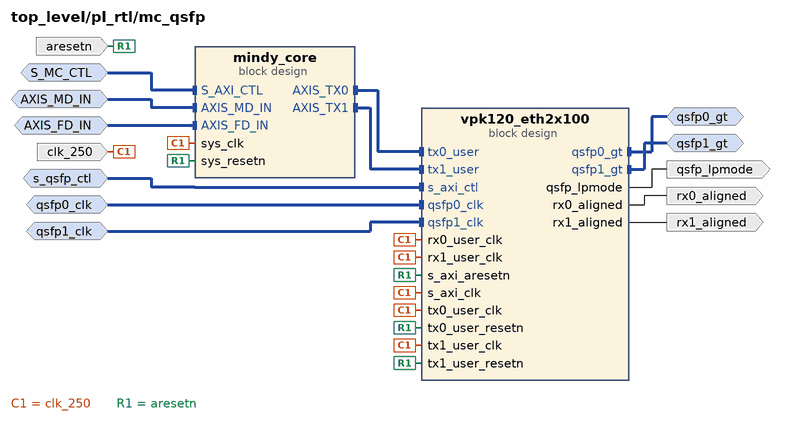
[diagram p9: block diagram inside /pl_rtl/mc_qsfp]
create_bd_intf_pin -mode Slave -vlnv xilinx.com:interface:axis_rtl:1.0 AXIS_FD_IN
create_bd_intf_pin -mode Slave -vlnv xilinx.com:interface:aximm_rtl:1.0 S_MC_CTL
create_bd_intf_pin -mode Slave -vlnv xilinx.com:interface:axis_rtl:1.0 AXIS_MD_IN
create_bd_intf_pin -mode Slave -vlnv xilinx.com:interface:aximm_rtl:1.0 s_qsfp_ctl
create_bd_intf_pin -mode Slave -vlnv xilinx.com:interface:diff_clock_rtl:1.0 qsfp0_clk
create_bd_intf_pin -mode Slave -vlnv xilinx.com:interface:diff_clock_rtl:1.0 qsfp1_clk
create_bd_intf_pin -mode Master -vlnv xilinx.com:interface:gt_rtl:1.0 qsfp1_gt
create_bd_intf_pin -mode Master -vlnv xilinx.com:interface:gt_rtl:1.0 qsfp0_gt
create_bd_pin -dir I -type clk clk_250
create_bd_pin -dir I -type rst aresetn
create_bd_pin -dir O rx1_aligned
create_bd_pin -dir O qsfp_lpmode
create_bd_pin -dir O rx0_aligned

create_bd_cell -type container -reference mindy_core mindy_core
set_property -dict [list \
  CONFIG.ACTIVE_SIM_BD mindy_core.bd \
  CONFIG.ACTIVE_SYNTH_BD mindy_core.bd \
  CONFIG.ENABLE_DFX 0 \
  CONFIG.LIST_SIM_BD mindy_core.bd \
  CONFIG.LIST_SYNTH_BD mindy_core.bd \
  CONFIG.LOCK_PROPAGATE 0 \
] [get_bd_cells mindy_core]
create_bd_cell -type container -reference vpk120_eth2x100 vpk120_eth2x100
set_property -dict [list \
  CONFIG.ACTIVE_SIM_BD vpk120_eth2x100.bd \
  CONFIG.ACTIVE_SYNTH_BD vpk120_eth2x100.bd \
  CONFIG.ENABLE_DFX 0 \
  CONFIG.LIST_SIM_BD vpk120_eth2x100.bd \
  CONFIG.LIST_SYNTH_BD vpk120_eth2x100.bd \
  CONFIG.LOCK_PROPAGATE 0 \
] [get_bd_cells vpk120_eth2x100]

# ---- connections ----

current_bd_instance /pl_rtl
connect_bd_intf_net [get_bd_intf_pins abm_and_smem/AXI_CLOCK_CTL] [get_bd_intf_pins icn_ctrl/M04_AXI]
connect_bd_intf_net [get_bd_intf_pins S00_AXI] [get_bd_intf_pins icn_ctrl/S00_AXI]
connect_bd_intf_net [get_bd_intf_pins adc_bank/S_AXI] [get_bd_intf_pins icn_ctrl/M05_AXI]
connect_bd_intf_net [get_bd_intf_pins lvds/S_AXI] [get_bd_intf_pins icn_ctrl/M01_AXI]
connect_bd_intf_net [get_bd_intf_pins frame_gen/S_AXI] [get_bd_intf_pins icn_ctrl/M07_AXI]
connect_bd_intf_net [get_bd_intf_pins abm_and_smem/S_AXI_CTL] [get_bd_intf_pins icn_ctrl/M02_AXI]
connect_bd_intf_net [get_bd_intf_pins mc_qsfp/S_MC_CTL] [get_bd_intf_pins icn_ctrl/M08_AXI]
connect_bd_intf_net [get_bd_intf_pins M_AXI_RAM0_PCI] [get_bd_intf_pins abm_and_smem/M_AXI_RAM0_PCI]
connect_bd_intf_net [get_bd_intf_pins M_AXI_RAM1_PCI] [get_bd_intf_pins abm_and_smem/M_AXI_RAM1_PCI]
connect_bd_intf_net [get_bd_intf_pins axi_uart_bridge/M_AXI] [get_bd_intf_pins icn_ctrl/S01_AXI]
connect_bd_intf_net [get_bd_intf_pins UART] [get_bd_intf_pins axi_uart_bridge/UART]
connect_bd_intf_net [get_bd_intf_pins LVDS_CLK] [get_bd_intf_pins clk_192/LVDS_CLK]
connect_bd_intf_net [get_bd_intf_pins frame_gen/axis_md] [get_bd_intf_pins mc_qsfp/AXIS_MD_IN]
connect_bd_intf_net [get_bd_intf_pins qsfp0_gt] [get_bd_intf_pins mc_qsfp/qsfp0_gt]
connect_bd_intf_net [get_bd_intf_pins qsfp1_gt] [get_bd_intf_pins mc_qsfp/qsfp1_gt]
connect_bd_intf_net [get_bd_intf_pins icn_ctrl/M00_AXI] [get_bd_intf_pins axi_intc_0/s_axi]
connect_bd_intf_net [get_bd_intf_pins axi_revision/S_AXI] [get_bd_intf_pins icn_ctrl/M03_AXI]
connect_bd_intf_net [get_bd_intf_pins chip_power_ctl/S_AXI] [get_bd_intf_pins icn_ctrl/M06_AXI]
connect_bd_intf_net [get_bd_intf_pins icn_ctrl/M09_AXI] [get_bd_intf_pins mc_qsfp/s_qsfp_ctl]
connect_bd_intf_net [get_bd_intf_pins lvds/axis_out] [get_bd_intf_pins mc_qsfp/AXIS_FD_IN]
connect_bd_intf_net [get_bd_intf_pins qsfp0_clk] [get_bd_intf_pins mc_qsfp/qsfp0_clk]
connect_bd_intf_net [get_bd_intf_pins qsfp1_clk] [get_bd_intf_pins mc_qsfp/qsfp1_clk]
connect_bd_net [get_bd_pins CHIP_PA_SYNC] [get_bd_pins frame_gen/CHIP_PA_SYNC]
connect_bd_net [get_bd_pins LVDS_BANKA_clk_n] [get_bd_pins lvds/LVDS_BANKA_clk_n]
connect_bd_net [get_bd_pins LVDS_BANKA_clk_p] [get_bd_pins lvds/LVDS_BANKA_clk_p]
connect_bd_net [get_bd_pins LVDS_DN] [get_bd_pins lvds/LVDS_DN]
connect_bd_net [get_bd_pins UCI_ADC_MISO] [get_bd_pins adc_bank/spi_miso]
connect_bd_net [get_bd_pins abm_and_smem/pin_hsi_cmd] [get_bd_pins pin_hsi_cmd]
connect_bd_net [get_bd_pins abm_and_smem/pin_hsi_data] [get_bd_pins pin_hsi_data]
connect_bd_net [get_bd_pins abm_and_smem/pin_hsi_pclk] [get_bd_pins pin_hsi_pclk]
connect_bd_net [get_bd_pins abm_and_smem/pin_hsi_valid] [get_bd_pins pin_hsi_valid]
connect_bd_net [get_bd_pins abm_and_smem/pin_spi_cs_n] [get_bd_pins pin_spi_cs_n]
connect_bd_net [get_bd_pins abm_and_smem/pin_spi_mosi] [get_bd_pins pin_spi_mosi]
connect_bd_net [get_bd_pins abm_and_smem/pin_spi_pclk] [get_bd_pins pin_spi_pclk]
connect_bd_net [get_bd_pins adc_bank/slave_select] [get_bd_pins UCI_ADC_CSN]
connect_bd_net [get_bd_pins adc_bank/spi_mosi] [get_bd_pins UCI_ADC_MOSI]
connect_bd_net [get_bd_pins adc_bank/spi_sclk] [get_bd_pins UCI_ADC_SCK]
connect_bd_net -net axi_intc_irq [get_bd_pins axi_intc_0/irq] [get_bd_pins irq]
connect_bd_net [get_bd_pins chip_power_ctl/chip_reset_n] [get_bd_pins CHIP_RSTB]
connect_bd_net [get_bd_pins chip_power_ctl/chip_vdd] [get_bd_pins CHIP_VDD]
connect_bd_net [get_bd_pins chip_power_ctl/chip_vdda] [get_bd_pins CHIP_VDDA]
connect_bd_net [get_bd_pins chip_power_ctl/chip_vddio] [get_bd_pins CHIP_VDDIO]
connect_bd_net [get_bd_pins chip_power_ctl/chip_vddlvds] [get_bd_pins CHIP_VDDLVDS]
connect_bd_net [get_bd_pins chip_power_ctl/lvl_trsl_oe_n] [get_bd_pins LVL_TRSL_OE_N]
connect_bd_net -net clk_192_1 [get_bd_pins clk_192/clk_192] [get_bd_pins lvds/clk_192] [get_bd_pins icn_ctrl/aclk1] [get_bd_pins frame_gen/clk_192]
connect_bd_net -net clk_200_1 [get_bd_pins clk_200] [get_bd_pins clk_192/clk_200]
connect_bd_net -net clk_wizard_0_clk_out1 [get_bd_pins clk_250] \
  [get_bd_pins icn_ctrl/aclk] [get_bd_pins axi_uart_bridge/aclk] [get_bd_pins axi_revision/AXI_ACLK] \
  [get_bd_pins axi_intc_0/s_axi_aclk] [get_bd_pins abm_and_smem/sys_clk] [get_bd_pins adc_bank/clk] \
  [get_bd_pins chip_power_ctl/clk] [get_bd_pins lvds/sys_clk] [get_bd_pins frame_gen/sys_clk] [get_bd_pins mc_qsfp/clk_250]
connect_bd_net -net constants_CHIP_GPIO13 [get_bd_pins frame_gen/CHIP_GPIO13] [get_bd_pins CHIP_GPIO13]
connect_bd_net -net constants_CHIP_GPIO15 [get_bd_pins frame_gen/CHIP_GPIO15] [get_bd_pins CHIP_GPIO15]
connect_bd_net -net constants_CHIP_GPIO15_DIR [get_bd_pins frame_gen/CHIP_GPIO15_DIR] [get_bd_pins CHIP_GPIO15_DIR]
connect_bd_net -net constants_CHIP_GPIO_BYTE_DIR [get_bd_pins frame_gen/CHIP_GPIO_BYTE_DIR] [get_bd_pins CHIP_GPIO_BYTE_DIR]
connect_bd_net -net constants_CHIP_RS0 [get_bd_pins frame_gen/CHIP_RS0] [get_bd_pins CHIP_RS0]
connect_bd_net -net constants_CHIP_RS256 [get_bd_pins frame_gen/CHIP_RS256] [get_bd_pins CHIP_RS256]
connect_bd_net -net data_a_p_0_1 [get_bd_pins LVDS_DP] [get_bd_pins lvds/LVDS_DP]
connect_bd_net [get_bd_pins dummy_intr/dout] [get_bd_pins axi_intc_0/intr]
connect_bd_net -net hier_0_qsfp_lpmode [get_bd_pins mc_qsfp/qsfp_lpmode] [get_bd_pins qsfp_lpmode]
connect_bd_net -net hier_0_rx0_aligned [get_bd_pins mc_qsfp/rx0_aligned] [get_bd_pins rx0_aligned]
connect_bd_net -net hier_0_rx1_aligned [get_bd_pins mc_qsfp/rx1_aligned] [get_bd_pins rx1_aligned]
connect_bd_net -net ilconstant_0_dout [get_bd_pins one/dout] [get_bd_pins abm_and_smem/sys_smem_wen]
connect_bd_net [get_bd_pins pin_spi_miso] [get_bd_pins abm_and_smem/pin_spi_miso]
connect_bd_net -net proc_sys_reset_0_peripheral_aresetn [get_bd_pins aresetn] \
  [get_bd_pins icn_ctrl/aresetn] [get_bd_pins axi_uart_bridge/aresetn] [get_bd_pins axi_revision/AXI_ARESETN] \
  [get_bd_pins axi_intc_0/s_axi_aresetn] [get_bd_pins abm_and_smem/sys_resetn] [get_bd_pins clk_192/resetn] \
  [get_bd_pins adc_bank/resetn] [get_bd_pins chip_power_ctl/resetn] [get_bd_pins mc_qsfp/aresetn]

current_bd_instance /pl_rtl/axi_uart_bridge
connect_bd_intf_net [get_bd_intf_pins M_AXI] [get_bd_intf_pins axi_uart_bridge/M_AXI]
connect_bd_intf_net [get_bd_intf_pins axi_uartlite/S_AXI] [get_bd_intf_pins axi_uart_bridge/M_UART]
connect_bd_intf_net [get_bd_intf_pins UART] [get_bd_intf_pins axi_uartlite/UART]
connect_bd_net [get_bd_pins aclk] [get_bd_pins axi_uart_bridge/aclk] [get_bd_pins axi_uartlite/s_axi_aclk]
connect_bd_net [get_bd_pins aresetn] [get_bd_pins axi_uart_bridge/aresetn] [get_bd_pins axi_uartlite/s_axi_aresetn]
connect_bd_net [get_bd_pins axi_uartlite/interrupt] [get_bd_pins axi_uart_bridge/UART_INT]

current_bd_instance /pl_rtl/clk_192
connect_bd_intf_net [get_bd_intf_pins LVDS_CLK] [get_bd_intf_pins util_ds_buf/CLK_OUT_D3]
connect_bd_net -net clk_200_1 [get_bd_pins clk_200] [get_bd_pins clk_wizard_768/clk_in1]
connect_bd_net -net clk_wizard_clk_192 [get_bd_pins clk_wizard_192/clk_192] [get_bd_pins xpm_aresetn_sync/dest_clk] [get_bd_pins clk_192]
connect_bd_net -net clk_wizard_clk_768 [get_bd_pins clk_wizard_768/clk_768] [get_bd_pins util_ds_buf/OBUF_IN] [get_bd_pins clk_wizard_192/clk_in1]
connect_bd_net [get_bd_pins resetn] [get_bd_pins xpm_aresetn_sync/src_arst]
connect_bd_net -net xpm_cdc_gen_0_dest_arst [get_bd_pins xpm_aresetn_sync/dest_arst] [get_bd_pins resetn_192]

current_bd_instance /pl_rtl/adc_bank
connect_bd_intf_net [get_bd_intf_pins S_AXI] [get_bd_intf_pins axi_adc_bank/S_AXI]
connect_bd_net [get_bd_pins clk] [get_bd_pins axi_adc_bank/clk] [get_bd_pins ltc1867l/clk]
connect_bd_net [get_bd_pins ltc1867l/adc_values] [get_bd_pins axi_adc_bank/adc]
connect_bd_net [get_bd_pins ltc1867l/slave_select] [get_bd_pins slave_select]
connect_bd_net [get_bd_pins ltc1867l/spi_mosi] [get_bd_pins spi_mosi]
connect_bd_net [get_bd_pins ltc1867l/spi_sclk] [get_bd_pins spi_sclk]
connect_bd_net [get_bd_pins resetn] [get_bd_pins ltc1867l/resetn] [get_bd_pins axi_adc_bank/resetn]
connect_bd_net [get_bd_pins spi_miso] [get_bd_pins ltc1867l/spi_miso]

current_bd_instance /pl_rtl/frame_gen
connect_bd_intf_net [get_bd_intf_pins S_AXI] [get_bd_intf_pins framegen_ctl/S_AXI]
connect_bd_intf_net [get_bd_intf_pins lvds_cdc/S_AXIS] [get_bd_intf_pins framegen_ctl/axis_md]
connect_bd_intf_net [get_bd_intf_pins axis_md] [get_bd_intf_pins lvds_cdc/M_AXIS]
connect_bd_net [get_bd_pins CHIP_PA_SYNC] [get_bd_pins cdc_pa_sync/src_in] [get_bd_pins framegen_ctl/pa_sync_raw]
connect_bd_net [get_bd_pins cdc_pa_sync/dest_out] [get_bd_pins pa_sync_ila/probe0]
connect_bd_net -net clk_192_1 [get_bd_pins clk_192] \
  [get_bd_pins cdc_pa_sync/dest_clk] [get_bd_pins pa_sync_ila/clk] [get_bd_pins lvds_cdc/s_axis_aclk] \
  [get_bd_pins framegen_ctl/clk]
connect_bd_net [get_bd_pins framegen_ctl/rs0] [get_bd_pins CHIP_RS0]
connect_bd_net [get_bd_pins framegen_ctl/rs256] [get_bd_pins CHIP_RS256]
connect_bd_net [get_bd_pins one/dout] [get_bd_pins CHIP_GPIO15_DIR] [get_bd_pins lvds_cdc/s_axis_aresetn] [get_bd_pins framegen_ctl/resetn]
connect_bd_net [get_bd_pins sys_clk] [get_bd_pins lvds_cdc/m_axis_aclk]
connect_bd_net [get_bd_pins zero/dout] \
  [get_bd_pins CHIP_GPIO13] [get_bd_pins CHIP_GPIO_BYTE_DIR] [get_bd_pins CHIP_GPIO15] [get_bd_pins cdc_pa_sync/src_clk]

current_bd_instance /pl_rtl/lvds
connect_bd_intf_net [get_bd_intf_pins S_AXI] [get_bd_intf_pins lvds_ctl/S_AXI]
connect_bd_intf_net [get_bd_intf_pins axis_out] [get_bd_intf_pins lvds_datapath/axis_out]
connect_bd_intf_net [get_bd_intf_pins lvds_datapath/missing_hdr] [get_bd_intf_pins lvds_ctl/missing_hdr]
connect_bd_net [get_bd_pins LVDS_BANKA_clk_n] [get_bd_pins advio/LVDS_BANKA_clk_n]
connect_bd_net [get_bd_pins LVDS_BANKA_clk_p] [get_bd_pins advio/LVDS_BANKA_clk_p]
connect_bd_net [get_bd_pins LVDS_DN] [get_bd_pins advio/LVDS_DN]
connect_bd_net -net advanced_io_wizard_0_data_to_fabric_data_a [get_bd_pins advio/data_to_fabric_data_a] [get_bd_pins lvds_bitslip/input_bus]
connect_bd_net -net clk_192_1 [get_bd_pins clk_192] \
  [get_bd_pins advio/clk_192] [get_bd_pins lvds_advio_mgr/clk] [get_bd_pins lvds_bitslip/clk] [get_bd_pins lvds_ctl/clk] \
  [get_bd_pins axis_ila/clk] [get_bd_pins lvds_align_detect/clk] [get_bd_pins lvds_prbs15_check_0/clk] \
  [get_bd_pins lvds_datapath/clk_192]
connect_bd_net -net data_a_p_0_1 [get_bd_pins LVDS_DP] [get_bd_pins advio/LVDS_DP]
connect_bd_net [get_bd_pins lvds_advio_mgr/cal_write_en] [get_bd_pins lvds_ctl/cal_write_en]
connect_bd_net [get_bd_pins lvds_advio_mgr/rx_cntvaluein] [get_bd_pins advio/rxtx_cntvaluein_data_a]
connect_bd_net [get_bd_pins lvds_advio_mgr/rx_ld] [get_bd_pins advio/rxtx_ld_data_a]
connect_bd_net [get_bd_pins lvds_advio_mgr/rxen_vtc] [get_bd_pins advio/rxen_vtc_data_a]
connect_bd_net -net lvds_align_detect_0_align_err [get_bd_pins lvds_align_detect/align_err] [get_bd_pins lvds_ctl/align_err]
connect_bd_net -net lvds_bitslip_0_bitslip_rd [get_bd_pins lvds_bitslip/bitslip_rd] [get_bd_pins lvds_ctl/cal_bitslip_rd]
connect_bd_net -net lvds_bitslip_0_dbg_lvds_lane [get_bd_pins lvds_bitslip/dbg_lvds_lane] [get_bd_pins axis_ila/probe1]
connect_bd_net -net lvds_bitslip_0_lvds_bus [get_bd_pins lvds_bitslip/lvds_bus] \
  [get_bd_pins lvds_align_detect/lvds_bus] [get_bd_pins lvds_prbs15_check_0/lvds_bus] [get_bd_pins lvds_datapath/lvds_in] \
  [get_bd_pins axis_ila/probe2]
connect_bd_net -net lvds_ctl_0_cal_mask [get_bd_pins lvds_ctl/cal_mask] [get_bd_pins lvds_bitslip/cal_mask] [get_bd_pins lvds_advio_mgr/cal_mask]
connect_bd_net -net lvds_ctl_0_cal_word [get_bd_pins lvds_ctl/cal_word] [get_bd_pins lvds_bitslip/cal_word] [get_bd_pins lvds_advio_mgr/cal_word]
connect_bd_net -net lvds_ctl_0_cal_word_wstb [get_bd_pins lvds_ctl/cal_word_wstb] \
  [get_bd_pins lvds_bitslip/cal_word_wstb] [get_bd_pins lvds_advio_mgr/cal_word_wstb]
connect_bd_net [get_bd_pins lvds_ctl/clear_errors_stb] [get_bd_pins lvds_align_detect/clear_errors] [get_bd_pins lvds_prbs15_check_0/clear_errors]
connect_bd_net [get_bd_pins lvds_ctl/frame_header] [get_bd_pins lvds_datapath/frame_header]
connect_bd_net [get_bd_pins lvds_ctl/hdr_match_bits] [get_bd_pins lvds_datapath/match_bits]
connect_bd_net [get_bd_pins lvds_ctl/lane_select] [get_bd_pins lvds_bitslip/lane_select]
connect_bd_net [get_bd_pins lvds_ctl/reset_hssio] [get_bd_pins advio/soft_reset]
connect_bd_net [get_bd_pins lvds_datapath/dbg_header_detected] [get_bd_pins axis_ila/probe0]
connect_bd_net -net lvds_framer_framing_errors [get_bd_pins lvds_datapath/framing_errors] [get_bd_pins lvds_ctl/framing_errors]
connect_bd_net -net lvds_framer_max_lane_skew [get_bd_pins lvds_datapath/max_lane_skew] [get_bd_pins lvds_ctl/max_lane_skew]
connect_bd_net [get_bd_pins lvds_prbs15_check_0/prbs_err] [get_bd_pins lvds_ctl/prbs_err]
connect_bd_net [get_bd_pins lvds_resetn/dout] \
  [get_bd_pins lvds_advio_mgr/resetn] [get_bd_pins lvds_ctl/resetn] [get_bd_pins lvds_bitslip/resetn] \
  [get_bd_pins lvds_datapath/resetn]
connect_bd_net [get_bd_pins sys_clk] [get_bd_pins lvds_datapath/sys_clk]

current_bd_instance /pl_rtl/lvds/advio
connect_bd_net [get_bd_pins LVDS_BANKA_clk_n] [get_bd_pins advanced_io_wizard/Strobe_0_n]
connect_bd_net [get_bd_pins LVDS_BANKA_clk_p] [get_bd_pins advanced_io_wizard/Strobe_0_p]
connect_bd_net [get_bd_pins LVDS_DN] [get_bd_pins advanced_io_wizard/data_a_n]
connect_bd_net -net advanced_io_wizard_0_intf_rdy [get_bd_pins advanced_io_wizard/intf_rdy] [get_bd_pins lvds_advio_reset_mgr/async_intf_rdy]
connect_bd_net [get_bd_pins advanced_io_wizard/bank0_pll_locked] [get_bd_pins lvds_advio_reset_mgr/async_bank0_pll_locked]
connect_bd_net [get_bd_pins advanced_io_wizard/data_to_fabric_data_a] [get_bd_pins data_to_fabric_data_a]
connect_bd_net [get_bd_pins advanced_io_wizard/dly_rdy] [get_bd_pins lvds_advio_reset_mgr/async_dly_rdy]
connect_bd_net [get_bd_pins advanced_io_wizard/fifo_empty] [get_bd_pins lvds_advio_reset_mgr/async_fifo_empty]
connect_bd_net -net clk_192_1 [get_bd_pins clk_192] \
  [get_bd_pins lvds_startup/clk] [get_bd_pins advanced_io_wizard/bank0_pll_clkin] [get_bd_pins advanced_io_wizard/ctrl_clk] \
  [get_bd_pins advanced_io_wizard/fifo_rd_clk] [get_bd_pins lvds_advio_reset_mgr/clk]
connect_bd_net -net data_a_p_0_1 [get_bd_pins LVDS_DP] [get_bd_pins advanced_io_wizard/data_a_p]
connect_bd_net [get_bd_pins lvds_advio_reset_mgr/en_vtc] [get_bd_pins advanced_io_wizard/en_vtc]
connect_bd_net [get_bd_pins lvds_advio_reset_mgr/fifo_rd_en] [get_bd_pins advanced_io_wizard/fifo_rd_en]
connect_bd_net [get_bd_pins lvds_advio_reset_mgr/rst] [get_bd_pins advanced_io_wizard/rst]
connect_bd_net -net rst_1 [get_bd_pins soft_reset] [get_bd_pins lvds_advio_reset_mgr/async_soft_reset]
connect_bd_net [get_bd_pins rxen_vtc_data_a] [get_bd_pins advanced_io_wizard/rxen_vtc_data_a]
connect_bd_net [get_bd_pins rxtx_cntvaluein_data_a] [get_bd_pins advanced_io_wizard/rxtx_cntvaluein_data_a]
connect_bd_net [get_bd_pins rxtx_ld_data_a] [get_bd_pins advanced_io_wizard/rxtx_ld_data_a]
connect_bd_net -net zero_0_dout [get_bd_pins zero_1/dout] \
  [get_bd_pins advanced_io_wizard/txen_vtc_Strobe_0] [get_bd_pins advanced_io_wizard/rxtx_ce_Strobe_0] \
  [get_bd_pins advanced_io_wizard/rxen_vtc_Strobe_0] [get_bd_pins advanced_io_wizard/rxtx_ld_Strobe_0] \
  [get_bd_pins advanced_io_wizard/rxtx_inc_Strobe_0] [get_bd_pins advanced_io_wizard/rxtx_sel_Strobe_0]
connect_bd_net [get_bd_pins zero_8/dout] \
  [get_bd_pins advanced_io_wizard/rxtx_sel_data_a] [get_bd_pins advanced_io_wizard/txen_vtc_data_a] \
  [get_bd_pins advanced_io_wizard/rxtx_ce_data_a] [get_bd_pins advanced_io_wizard/rxtx_inc_data_a]
connect_bd_net [get_bd_pins zero_9/dout] [get_bd_pins advanced_io_wizard/rxtx_cntvaluein_Strobe_0]
connect_bd_net -net zero_dout [get_bd_pins lvds_startup/reset_out] [get_bd_pins advanced_io_wizard/bank0_pll_rst_pll]

current_bd_instance /pl_rtl/lvds/lvds_datapath
connect_bd_intf_net [get_bd_intf_pins axis_out] [get_bd_intf_pins lvds_cdc/M_AXIS]
connect_bd_intf_net [get_bd_intf_pins missing_hdr] [get_bd_intf_pins lvds_framer/missing_hdr]
connect_bd_intf_net [get_bd_intf_pins lvds_cdc/S_AXIS] [get_bd_intf_pins lvds_lane_sync/axis_out]
connect_bd_net -net clk_192_1 [get_bd_pins clk_192] \
  [get_bd_pins lvds_framer/clk] [get_bd_pins lvds_8to64/clk] [get_bd_pins lvds_lane_sync/clk] \
  [get_bd_pins lvds_cdc/s_axis_aclk]
connect_bd_net -net lvds_8to64_0_lvds_out [get_bd_pins lvds_8to64/lvds_out] [get_bd_pins lvds_framer/lvds_in]
connect_bd_net -net lvds_bitslip_0_lvds_bus [get_bd_pins lvds_in] [get_bd_pins lvds_8to64/lvds_in]
connect_bd_net -net lvds_ctl_frame_header [get_bd_pins frame_header] [get_bd_pins lvds_framer/frame_header]
connect_bd_net -net lvds_ctl_hdr_match_bits [get_bd_pins match_bits] [get_bd_pins lvds_framer/match_bits]
connect_bd_net [get_bd_pins lvds_framer/dbg_header_detected] [get_bd_pins dbg_header_detected]
connect_bd_net [get_bd_pins lvds_framer/framing_errors] [get_bd_pins framing_errors]
connect_bd_net [get_bd_pins lvds_framer/lvds_out] [get_bd_pins lvds_lane_sync/lvds_in]
connect_bd_net [get_bd_pins lvds_framer/max_lane_skew] [get_bd_pins max_lane_skew]
connect_bd_net [get_bd_pins lvds_framer/valid] [get_bd_pins lvds_lane_sync/in_valid]
connect_bd_net -net lvds_resetn_dout [get_bd_pins resetn] \
  [get_bd_pins lvds_framer/resetn] [get_bd_pins lvds_lane_sync/resetn] [get_bd_pins lvds_cdc/s_axis_aresetn]
connect_bd_net [get_bd_pins sys_clk] [get_bd_pins lvds_cdc/m_axis_aclk]

current_bd_instance /pl_rtl/mc_qsfp
connect_bd_intf_net [get_bd_intf_pins vpk120_eth2x100/s_axi_ctl] [get_bd_intf_pins s_qsfp_ctl]
connect_bd_intf_net [get_bd_intf_pins vpk120_eth2x100/qsfp0_clk] [get_bd_intf_pins qsfp0_clk]
connect_bd_intf_net [get_bd_intf_pins vpk120_eth2x100/qsfp1_clk] [get_bd_intf_pins qsfp1_clk]
connect_bd_intf_net [get_bd_intf_pins vpk120_eth2x100/qsfp1_gt] [get_bd_intf_pins qsfp1_gt]
connect_bd_intf_net [get_bd_intf_pins vpk120_eth2x100/qsfp0_gt] [get_bd_intf_pins qsfp0_gt]
connect_bd_intf_net [get_bd_intf_pins S_MC_CTL] [get_bd_intf_pins mindy_core/S_AXI_CTL]
connect_bd_intf_net [get_bd_intf_pins AXIS_MD_IN] [get_bd_intf_pins mindy_core/AXIS_MD_IN]
connect_bd_intf_net [get_bd_intf_pins AXIS_FD_IN] [get_bd_intf_pins mindy_core/AXIS_FD_IN]
connect_bd_intf_net [get_bd_intf_pins vpk120_eth2x100/tx0_user] [get_bd_intf_pins mindy_core/AXIS_TX0]
connect_bd_intf_net [get_bd_intf_pins vpk120_eth2x100/tx1_user] [get_bd_intf_pins mindy_core/AXIS_TX1]
connect_bd_net -net clk_wizard_0_clk_out1 [get_bd_pins clk_250] \
  [get_bd_pins mindy_core/sys_clk] [get_bd_pins vpk120_eth2x100/tx1_user_clk] [get_bd_pins vpk120_eth2x100/rx0_user_clk] \
  [get_bd_pins vpk120_eth2x100/rx1_user_clk] [get_bd_pins vpk120_eth2x100/tx0_user_clk] \
  [get_bd_pins vpk120_eth2x100/s_axi_clk]
connect_bd_net -net proc_sys_reset_0_peripheral_aresetn [get_bd_pins aresetn] \
  [get_bd_pins mindy_core/sys_resetn] [get_bd_pins vpk120_eth2x100/tx0_user_resetn] \
  [get_bd_pins vpk120_eth2x100/tx1_user_resetn] [get_bd_pins vpk120_eth2x100/s_axi_aresetn]
connect_bd_net -net vpk120_eth2x100_0_qsfp_lpmode [get_bd_pins vpk120_eth2x100/qsfp_lpmode] [get_bd_pins qsfp_lpmode]
connect_bd_net -net vpk120_eth2x100_0_rx0_aligned [get_bd_pins vpk120_eth2x100/rx0_aligned] [get_bd_pins rx0_aligned]
connect_bd_net -net vpk120_eth2x100_0_rx1_aligned [get_bd_pins vpk120_eth2x100/rx1_aligned] [get_bd_pins rx1_aligned]
